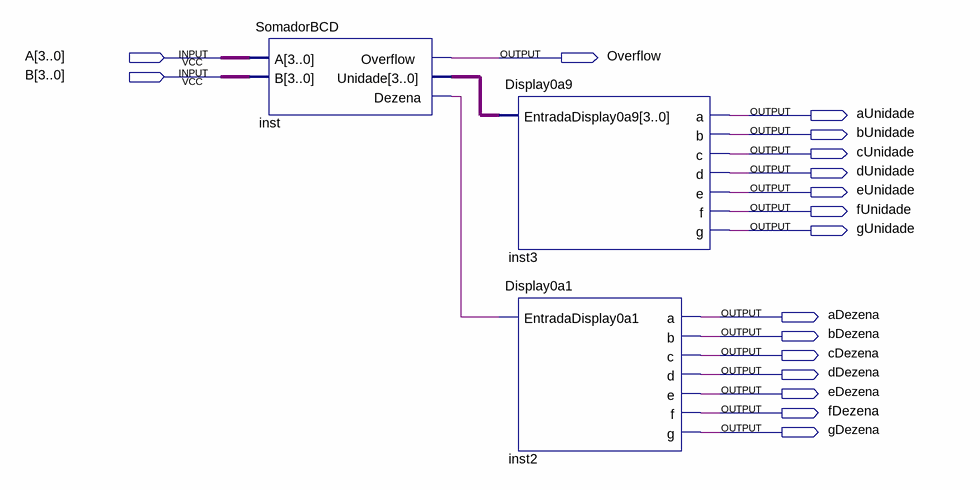
[diagram p0: schematic sheet]
// Quartus schematic SomadorBCDComDisplay.bdf as structural Verilog: 3 symbols, 17 pins
module SomadorBCDComDisplay (
  input  [3:0] A,
  input  [3:0] B,
  output Overflow,
  output aUnidade,
  output bUnidade,
  output cUnidade,
  output dUnidade,
  output eUnidade,
  output fUnidade,
  output gUnidade,
  output aDezena,
  output bDezena,
  output cDezena,
  output dDezena,
  output eDezena,
  output fDezena,
  output gDezena
);

  wire inst_dezena;
  wire [3:0] inst_unidade;

  SomadorBCD inst (.A(A), .B(B), .Overflow(Overflow), .Unidade(inst_unidade), .Dezena(inst_dezena));
  Display0a9 inst3 (
    .EntradaDisplay0a9(inst_unidade), .a(aUnidade), .b(bUnidade), .c(cUnidade), .d(dUnidade), .e(eUnidade),
    .f(fUnidade), .g(gUnidade));
  Display0a1 inst2 (
    .EntradaDisplay0a1(inst_dezena), .a(aDezena), .b(bDezena), .c(cDezena), .d(dDezena), .e(eDezena),
    .f(fDezena), .g(gDezena));
endmodule
